# Altium schematic sheet vme_can_fpga_bridge.SchDoc: =GlobalProjectName
size 594 x 420 mm; SheetNumber: 6; SheetTotal: 8; PageSetup: Record=PageOptions|CenterHorizontal=True|CenterVertical=True|PrintScale=1.00|XCorrection=1.00|YCorrection=1.00|PrintKind=1|BorderSize=5000000|LeftOffset=0|BottomOffset=0|Orientation=2|PaperLength=1000|PaperWidth=1000|Scale=100|PaperSource=15|PrintQuality=1200|MediaType=1|DitherType=10|PaperKind=A3|PrintScaleMode=1; Weight: -; ScaleFactor: -
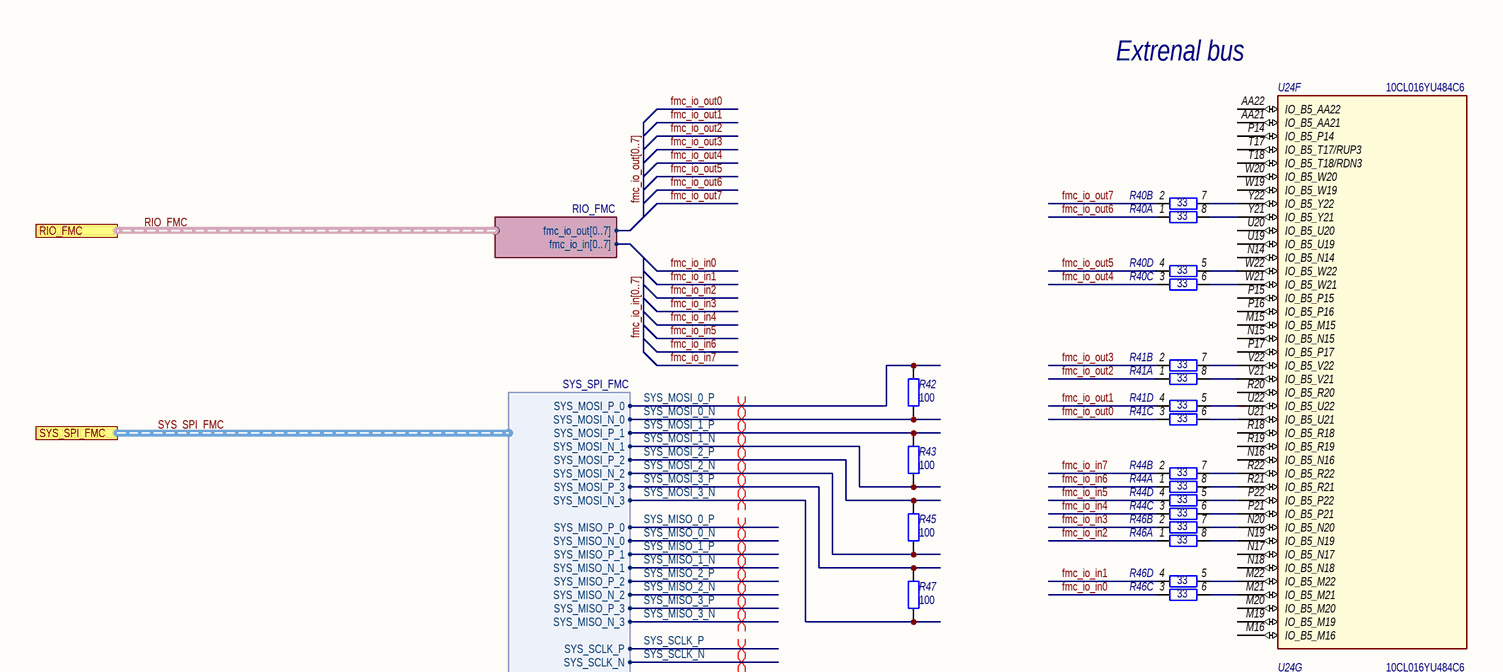
[diagram p0: vme_can_fpga_bridge.SchDoc, top left]
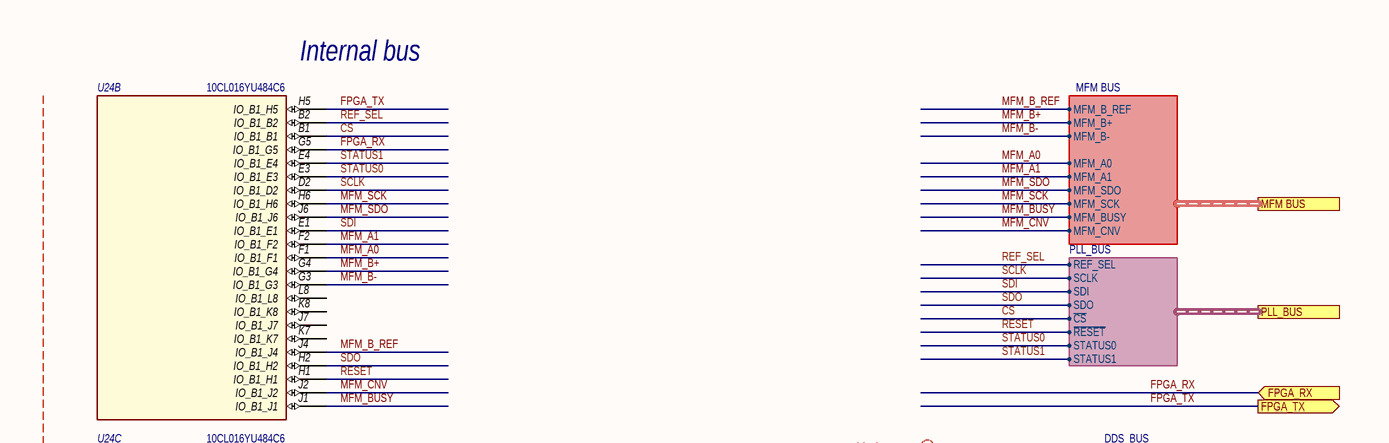
[diagram p1: vme_can_fpga_bridge.SchDoc, top right]
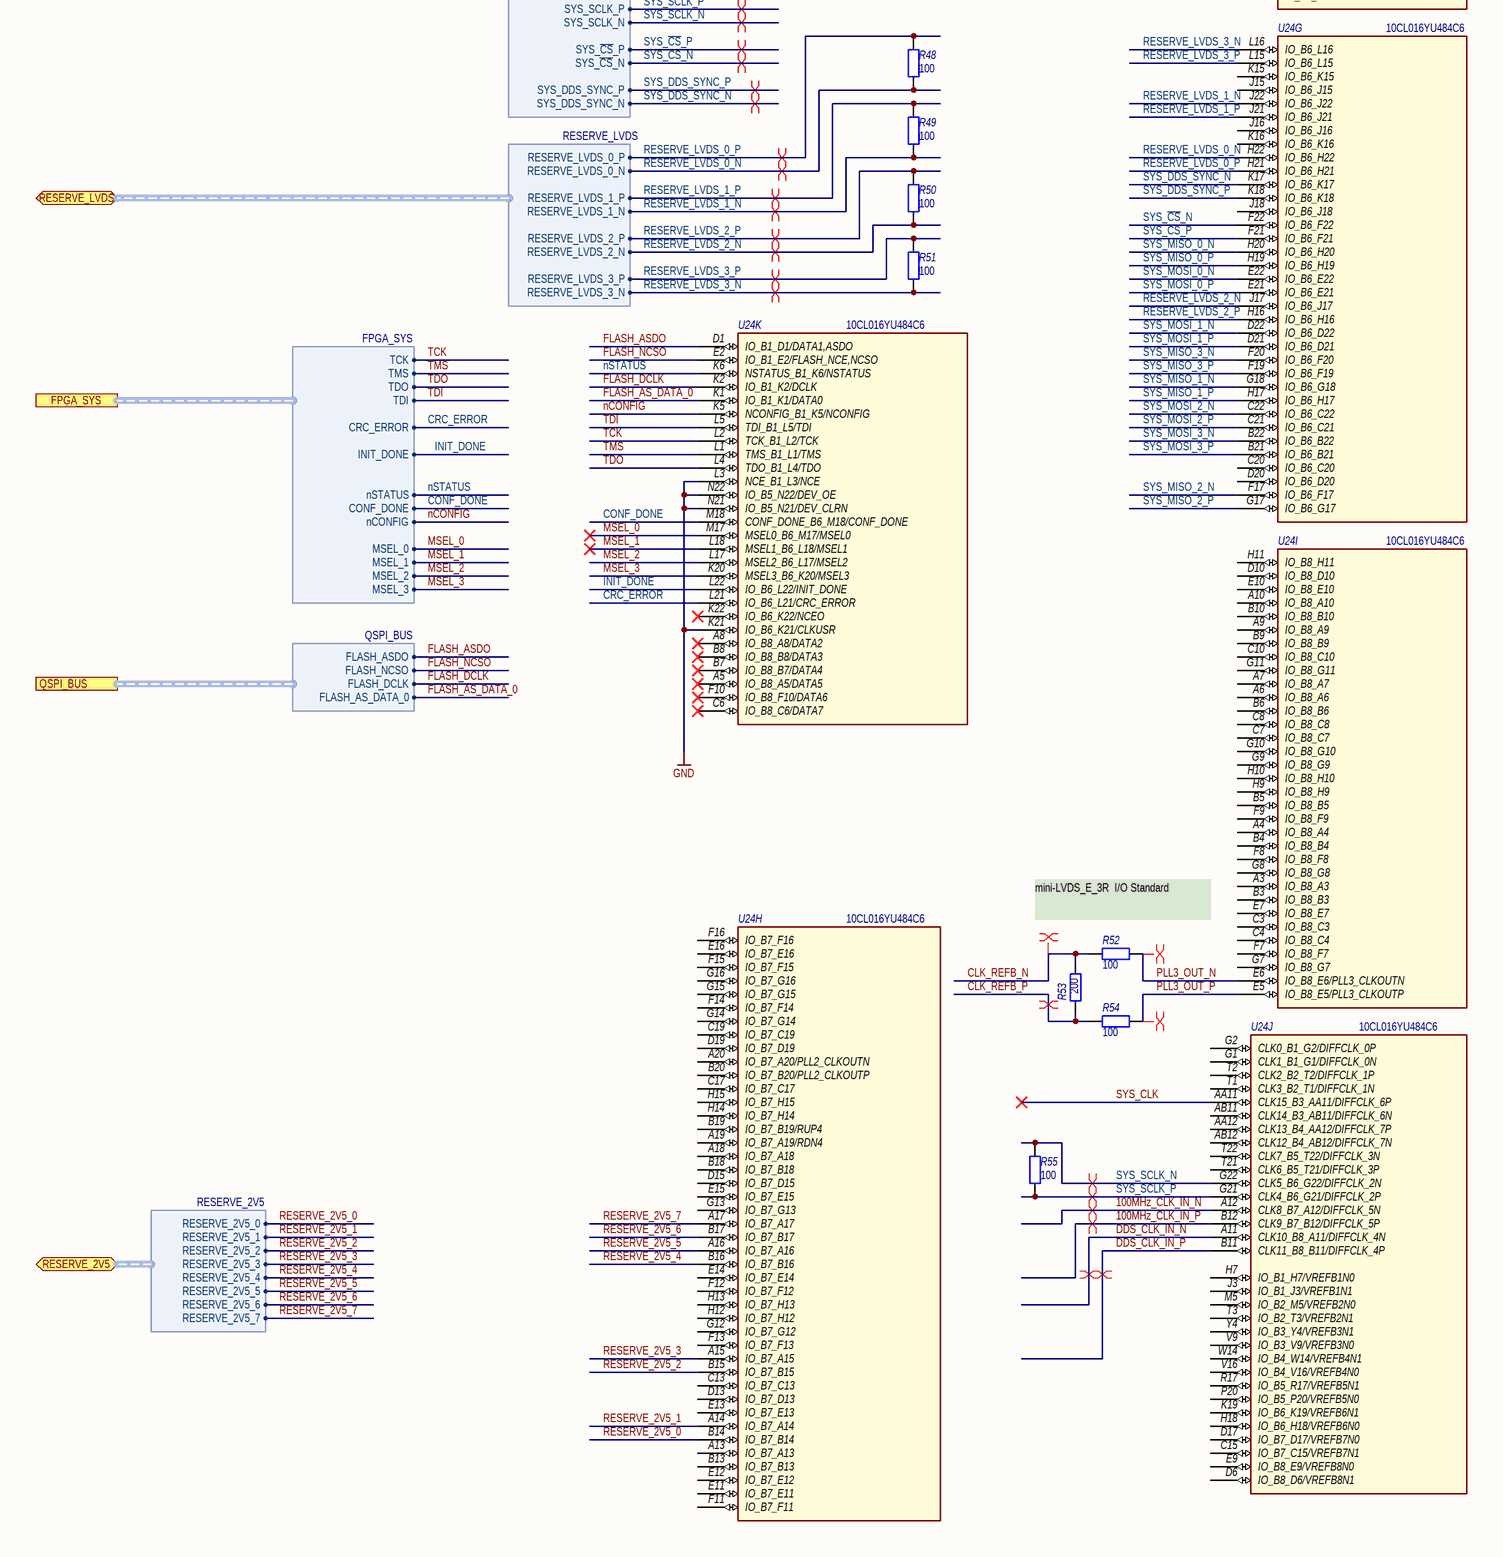
[diagram p2: vme_can_fpga_bridge.SchDoc, bottom left]
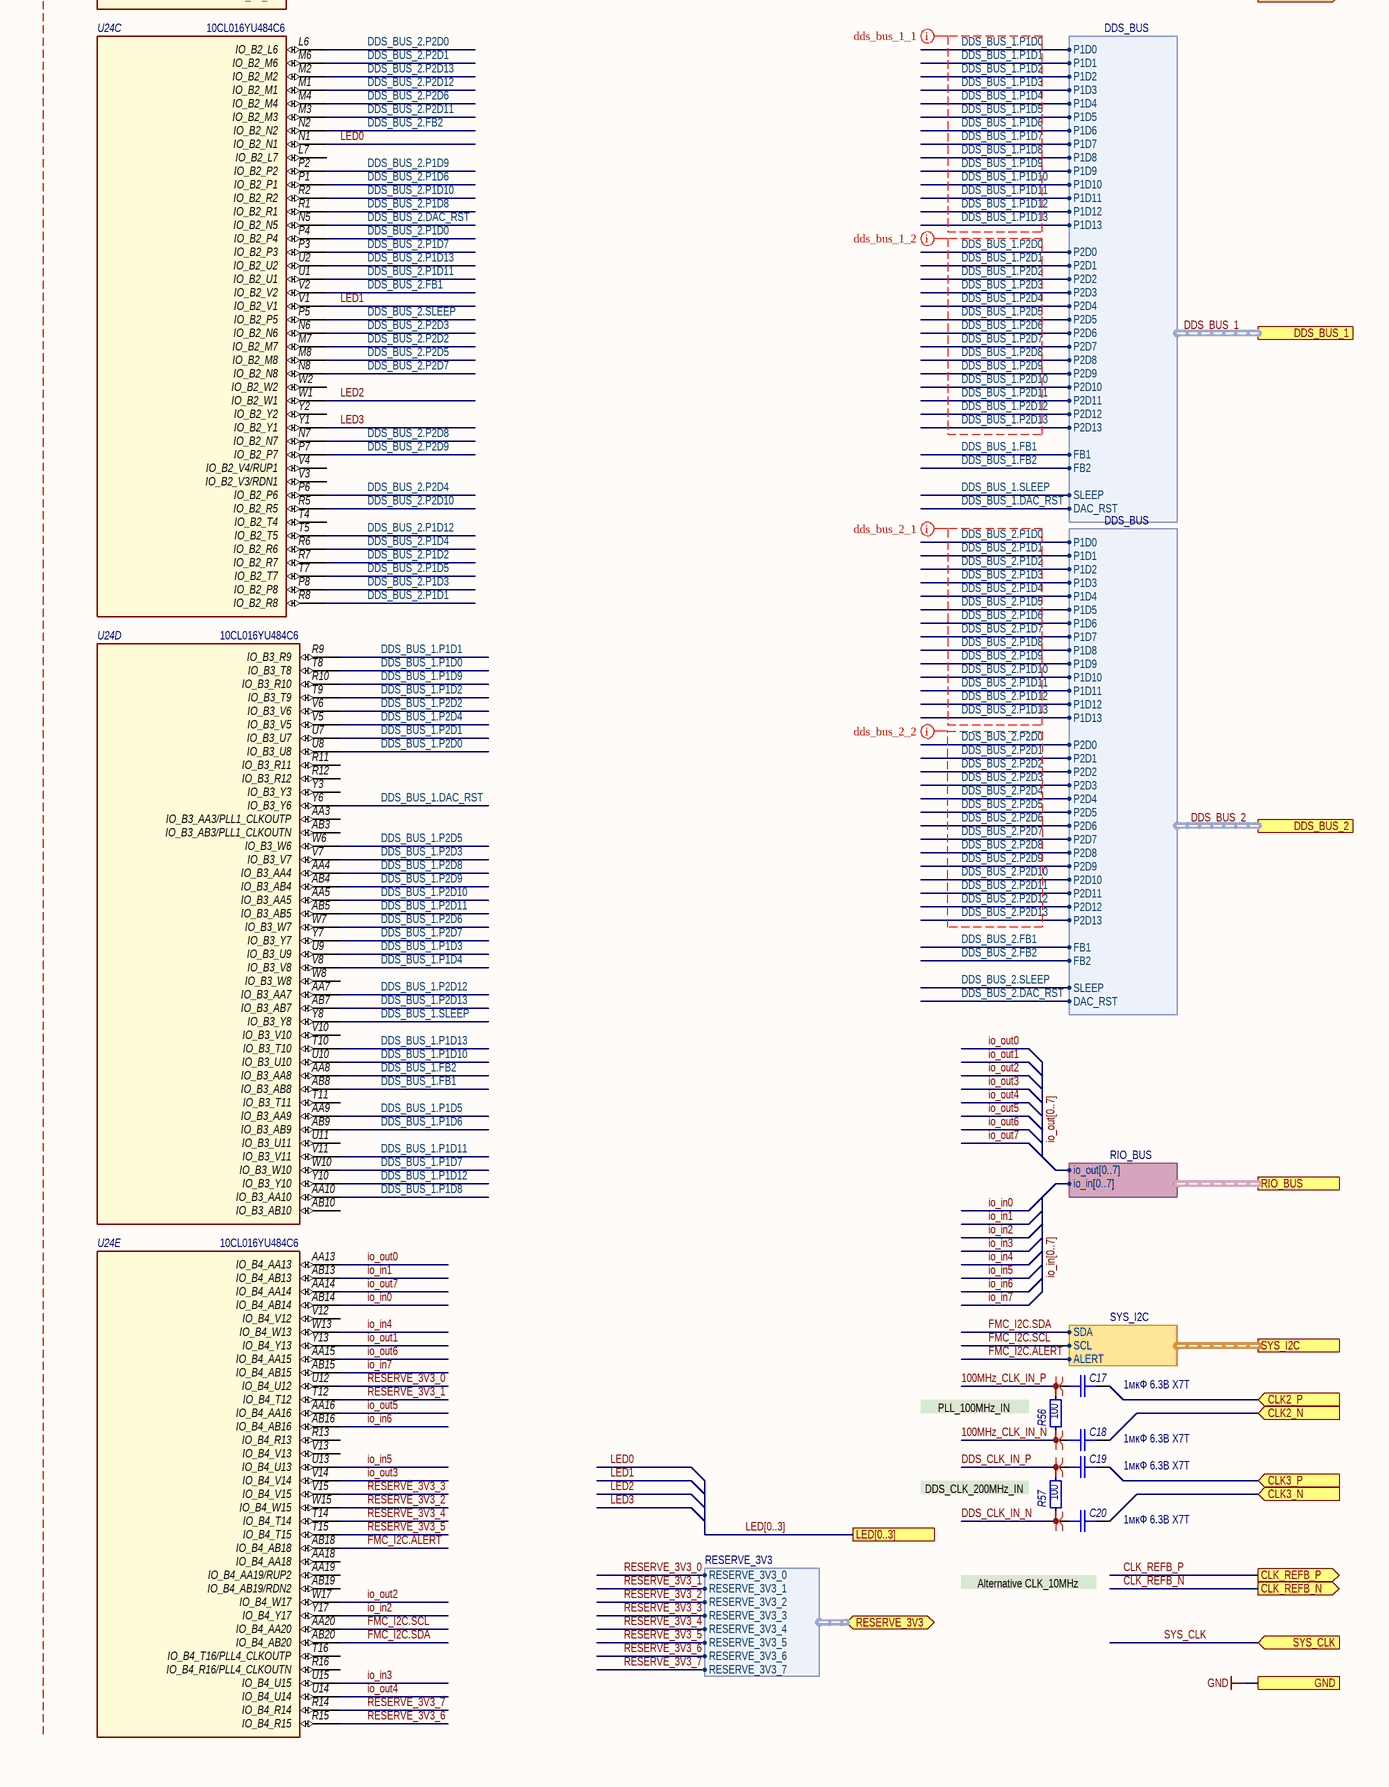
[diagram p3: vme_can_fpga_bridge.SchDoc, bottom right]

## Parts
C17  1мкФ 6.3В X7T  [SMD_C0603]
C18  1мкФ 6.3В X7T  [SMD_C0603]
C19  1мкФ 6.3В X7T  [SMD_C0603]
C20  1мкФ 6.3В X7T  [SMD_C0603]
R40  value 33  [TC124]  (hidden comment: 4 Chip Resistor Array)  (parts A,B,C,D of 4)
R41  value 33  [TC124]  (hidden comment: 4 Chip Resistor Array)  (parts A,B,C,D of 4)
R42  100  [SMD_0603]
R43  100  [SMD_0603]
R44  value 33  [TC124]  (hidden comment: 4 Chip Resistor Array)  (parts A,B,C,D of 4)
R45  100  [SMD_0603]
R46  value 33  [TC124]  (hidden comment: 4 Chip Resistor Array)  (parts A,B,C,D of 4)
R47  100  [SMD_0603]
R48  100  [SMD_0603]
R49  100  [SMD_0603]
R50  100  [SMD_0603]
R51  100  [SMD_0603]
R52  100  [SMD_0603]
R53  200  [SMD_0603]
R54  100  [SMD_0603]
R55  100  [SMD_0603]
R56  100  [SMD_0603]
R57  100  [SMD_0603]
U24  Наименование: 10CL016YU484С6  [UBGA-484]  (hidden comment: 10CL016YU484)  (parts B,C,D,E,F,G,H,I,J,K of 13)

## Ports
CLK2_N (in), CLK2_P (in), CLK3_N (in), CLK3_P (in), CLK_REFB_N (out), CLK_REFB_P (out), DDS_BUS_1 (harness DDS_BUS), DDS_BUS_2 (harness DDS_BUS), FPGA_RX (in), FPGA_SYS (harness FPGA_SYS), FPGA_TX (out), GND, LED[0..3], MFM BUS (harness MFM BUS), PLL_BUS (harness PLL_BUS), QSPI_BUS (harness QSPI_BUS), RESERVE_2V5 (bidir, harness RESERVE_2V5), RESERVE_3V3 (bidir, harness RESERVE_3V3), RESERVE_LVDS (bidir, harness RESERVE_LVDS), RIO_BUS (harness RIO_BUS), RIO_FMC (harness RIO_FMC), SYS_CLK (in), SYS_I2C (harness SYS_I2C), SYS_SPI_FMC (harness SYS_SPI_FMC)

## Harnesses
MFM BUS: MFM_A0, MFM_A1, MFM_SDO, MFM_SCK, MFM_BUSY, MFM_CNV, MFM_B_REF, MFM_B+, MFM_B-
RIO_FMC: fmc_io_out[0..7], fmc_io_in[0..7]
FPGA_SYS: TCK, TMS, TDO, TDI, CRC_ERROR, nSTATUS, CONF_DONE, nCONFIG, MSEL_0, MSEL_1, MSEL_2, MSEL_3, INIT_DONE
SYS_SPI_FMC: SYS_MOSI_P_0, SYS_SCLK_P, SYS_~{CS}_P, SYS_MOSI_P_1, SYS_MOSI_P_2, SYS_MOSI_P_3, SYS_MOSI_N_0, SYS_MOSI_N_1, SYS_MOSI_N_2, SYS_MOSI_N_3, SYS_MISO_P_0, SYS_MISO_P_1, SYS_MISO_P_2, SYS_MISO_P_3, SYS_MISO_N_0, SYS_MISO_N_1, SYS_MISO_N_2, SYS_MISO_N_3, SYS_SCLK_N, SYS_DDS_SYNC_P, SYS_~{CS}_N, SYS_DDS_SYNC_N
SYS_I2C: SDA, SCL, ALERT
PLL_BUS: REF_SEL, SCLK, SDI, SDO, ~{CS}, ~{RESET}, STATUS0, STATUS1
RIO_BUS: io_out[0..7], io_in[0..7]
RESERVE_LVDS: RESERVE_LVDS_0_P, RESERVE_LVDS_0_N, RESERVE_LVDS_1_P, RESERVE_LVDS_1_N, RESERVE_LVDS_2_P, RESERVE_LVDS_2_N, RESERVE_LVDS_3_P, RESERVE_LVDS_3_N
RESERVE_3V3: RESERVE_3V3_0, RESERVE_3V3_1, RESERVE_3V3_2, RESERVE_3V3_3, RESERVE_3V3_4, RESERVE_3V3_5, RESERVE_3V3_6, RESERVE_3V3_7
QSPI_BUS: FLASH_ASDO, FLASH_NCSO, FLASH_DCLK, FLASH_AS_DATA_0
RESERVE_2V5: RESERVE_2V5_0, RESERVE_2V5_1, RESERVE_2V5_2, RESERVE_2V5_3, RESERVE_2V5_4, RESERVE_2V5_5, RESERVE_2V5_6, RESERVE_2V5_7
DDS_BUS: P1D0, P1D1, P1D2, P1D3, P1D4, P1D5, P1D6, P1D7, P1D8, P1D9, P1D10, P1D11, P1D12, P1D13, P2D0, P2D1, P2D2, P2D3, P2D4, P2D5, P2D6, P2D7, P2D8, P2D9, P2D10, P2D11, P2D12, P2D13, FB1, SLEEP, DAC_RST, FB2

## Nets
GND: U24.K21(IO_B6_K21/CLKUSR) U24.L3(NCE_B1_L3/NCE) U24.N21(IO_B5_N21/DEV_CLRN) U24.N22(IO_B5_N22/DEV_OE) ; port GND
100MHz_CLK_IN_N: C18.1 R56.1 U24.A12(CLK8_B7_A12/DIFFCLK_5N)
100MHz_CLK_IN_P: C17.2 R56.2 U24.B12(CLK9_B7_B12/DIFFCLK_5P)
~{CS}: U24.B1(IO_B1_B1) ; port PLL_BUS.~{CS}
CLK2_N: C18.2 ; port CLK2_N
CLK2_P: C17.1 ; port CLK2_P
CLK3_N: C20.2 ; port CLK3_N
CLK3_P: C19.1 ; port CLK3_P
CLK_REFB_N: R52.2 R53.2 ; port CLK_REFB_N
CLK_REFB_P: R53.1 R54.2 ; port CLK_REFB_P
CONF_DONE: U24.M18(CONF_DONE_B6_M18/CONF_DONE) ; port FPGA_SYS.CONF_DONE
CRC_ERROR: U24.L21(IO_B6_L21/CRC_ERROR) ; port FPGA_SYS.CRC_ERROR
DDS_BUS_1.DAC_RST: U24.Y6(IO_B3_Y6) ; port DDS_BUS_1.DAC_RST
DDS_BUS_1.FB1: U24.AB8(IO_B3_AB8) ; port DDS_BUS_1.FB1
DDS_BUS_1.FB2: U24.AA8(IO_B3_AA8) ; port DDS_BUS_1.FB2
DDS_BUS_1.P1D0: U24.T8(IO_B3_T8) ; port DDS_BUS_1.P1D0
DDS_BUS_1.P1D1: U24.R9(IO_B3_R9) ; port DDS_BUS_1.P1D1
DDS_BUS_1.P1D2: U24.T9(IO_B3_T9) ; port DDS_BUS_1.P1D2
DDS_BUS_1.P1D3: U24.U9(IO_B3_U9) ; port DDS_BUS_1.P1D3
DDS_BUS_1.P1D4: U24.V8(IO_B3_V8) ; port DDS_BUS_1.P1D4
DDS_BUS_1.P1D5: U24.AA9(IO_B3_AA9) ; port DDS_BUS_1.P1D5
DDS_BUS_1.P1D6: U24.AB9(IO_B3_AB9) ; port DDS_BUS_1.P1D6
DDS_BUS_1.P1D7: U24.W10(IO_B3_W10) ; port DDS_BUS_1.P1D7
DDS_BUS_1.P1D8: U24.AA10(IO_B3_AA10) ; port DDS_BUS_1.P1D8
DDS_BUS_1.P1D9: U24.R10(IO_B3_R10) ; port DDS_BUS_1.P1D9
DDS_BUS_1.P1D10: U24.U10(IO_B3_U10) ; port DDS_BUS_1.P1D10
DDS_BUS_1.P1D11: U24.V11(IO_B3_V11) ; port DDS_BUS_1.P1D11
DDS_BUS_1.P1D12: U24.Y10(IO_B3_Y10) ; port DDS_BUS_1.P1D12
DDS_BUS_1.P1D13: U24.T10(IO_B3_T10) ; port DDS_BUS_1.P1D13
DDS_BUS_1.P2D0: U24.U8(IO_B3_U8) ; port DDS_BUS_1.P2D0
DDS_BUS_1.P2D1: U24.U7(IO_B3_U7) ; port DDS_BUS_1.P2D1
DDS_BUS_1.P2D2: U24.V6(IO_B3_V6) ; port DDS_BUS_1.P2D2
DDS_BUS_1.P2D3: U24.V7(IO_B3_V7) ; port DDS_BUS_1.P2D3
DDS_BUS_1.P2D4: U24.V5(IO_B3_V5) ; port DDS_BUS_1.P2D4
DDS_BUS_1.P2D5: U24.W6(IO_B3_W6) ; port DDS_BUS_1.P2D5
DDS_BUS_1.P2D6: U24.W7(IO_B3_W7) ; port DDS_BUS_1.P2D6
DDS_BUS_1.P2D7: U24.Y7(IO_B3_Y7) ; port DDS_BUS_1.P2D7
DDS_BUS_1.P2D8: U24.AA4(IO_B3_AA4) ; port DDS_BUS_1.P2D8
DDS_BUS_1.P2D9: U24.AB4(IO_B3_AB4) ; port DDS_BUS_1.P2D9
DDS_BUS_1.P2D10: U24.AA5(IO_B3_AA5) ; port DDS_BUS_1.P2D10
DDS_BUS_1.P2D11: U24.AB5(IO_B3_AB5) ; port DDS_BUS_1.P2D11
DDS_BUS_1.P2D12: U24.AA7(IO_B3_AA7) ; port DDS_BUS_1.P2D12
DDS_BUS_1.P2D13: U24.AB7(IO_B3_AB7) ; port DDS_BUS_1.P2D13
DDS_BUS_1.SLEEP: U24.Y8(IO_B3_Y8) ; port DDS_BUS_1.SLEEP
DDS_BUS_2.DAC_RST: U24.N5(IO_B2_N5) ; port DDS_BUS_2.DAC_RST
DDS_BUS_2.FB1: U24.V2(IO_B2_V2) ; port DDS_BUS_2.FB1
DDS_BUS_2.FB2: U24.N2(IO_B2_N2) ; port DDS_BUS_2.FB2
DDS_BUS_2.P1D0: U24.P4(IO_B2_P4) ; port DDS_BUS_2.P1D0
DDS_BUS_2.P1D1: U24.R8(IO_B2_R8) ; port DDS_BUS_2.P1D1
DDS_BUS_2.P1D2: U24.R7(IO_B2_R7) ; port DDS_BUS_2.P1D2
DDS_BUS_2.P1D3: U24.P8(IO_B2_P8) ; port DDS_BUS_2.P1D3
DDS_BUS_2.P1D4: U24.R6(IO_B2_R6) ; port DDS_BUS_2.P1D4
DDS_BUS_2.P1D5: U24.T7(IO_B2_T7) ; port DDS_BUS_2.P1D5
DDS_BUS_2.P1D6: U24.P1(IO_B2_P1) ; port DDS_BUS_2.P1D6
DDS_BUS_2.P1D7: U24.P3(IO_B2_P3) ; port DDS_BUS_2.P1D7
DDS_BUS_2.P1D8: U24.R1(IO_B2_R1) ; port DDS_BUS_2.P1D8
DDS_BUS_2.P1D9: U24.P2(IO_B2_P2) ; port DDS_BUS_2.P1D9
DDS_BUS_2.P1D10: U24.R2(IO_B2_R2) ; port DDS_BUS_2.P1D10
DDS_BUS_2.P1D11: U24.U1(IO_B2_U1) ; port DDS_BUS_2.P1D11
DDS_BUS_2.P1D12: U24.T5(IO_B2_T5) ; port DDS_BUS_2.P1D12
DDS_BUS_2.P1D13: U24.U2(IO_B2_U2) ; port DDS_BUS_2.P1D13
DDS_BUS_2.P2D0: U24.L6(IO_B2_L6) ; port DDS_BUS_2.P2D0
DDS_BUS_2.P2D1: U24.M6(IO_B2_M6) ; port DDS_BUS_2.P2D1
DDS_BUS_2.P2D2: U24.M7(IO_B2_M7) ; port DDS_BUS_2.P2D2
DDS_BUS_2.P2D3: U24.N6(IO_B2_N6) ; port DDS_BUS_2.P2D3
DDS_BUS_2.P2D4: U24.P6(IO_B2_P6) ; port DDS_BUS_2.P2D4
DDS_BUS_2.P2D5: U24.M8(IO_B2_M8) ; port DDS_BUS_2.P2D5
DDS_BUS_2.P2D6: U24.M4(IO_B2_M4) ; port DDS_BUS_2.P2D6
DDS_BUS_2.P2D7: U24.N8(IO_B2_N8) ; port DDS_BUS_2.P2D7
DDS_BUS_2.P2D8: U24.N7(IO_B2_N7) ; port DDS_BUS_2.P2D8
DDS_BUS_2.P2D9: U24.P7(IO_B2_P7) ; port DDS_BUS_2.P2D9
DDS_BUS_2.P2D10: U24.R5(IO_B2_R5) ; port DDS_BUS_2.P2D10
DDS_BUS_2.P2D11: U24.M3(IO_B2_M3) ; port DDS_BUS_2.P2D11
DDS_BUS_2.P2D12: U24.M1(IO_B2_M1) ; port DDS_BUS_2.P2D12
DDS_BUS_2.P2D13: U24.M2(IO_B2_M2) ; port DDS_BUS_2.P2D13
DDS_BUS_2.SLEEP: U24.P5(IO_B2_P5) ; port DDS_BUS_2.SLEEP
DDS_CLK_IN_N: C20.1 R57.1 U24.A11(CLK10_B8_A11/DIFFCLK_4N)
DDS_CLK_IN_P: C19.2 R57.2 U24.B11(CLK11_B8_B11/DIFFCLK_4P)
FLASH_AS_DATA_0: U24.K1(IO_B1_K1/DATA0) ; port QSPI_BUS.FLASH_AS_DATA_0
FLASH_ASDO: U24.D1(IO_B1_D1/DATA1,ASDO) ; port QSPI_BUS.FLASH_ASDO
FLASH_DCLK: U24.K2(IO_B1_K2/DCLK) ; port QSPI_BUS.FLASH_DCLK
FLASH_NCSO: U24.E2(IO_B1_E2/FLASH_NCE,NCSO) ; port QSPI_BUS.FLASH_NCSO
FMC_I2C.ALERT: U24.AB18(IO_B4_AB18) ; port SYS_I2C.ALERT
FMC_I2C.SCL: U24.AA20(IO_B4_AA20) ; port SYS_I2C.SCL
FMC_I2C.SDA: U24.AB20(IO_B4_AB20) ; port SYS_I2C.SDA
fmc_io_in0: R46.3
fmc_io_in1: R46.4
fmc_io_in2: R46.1
fmc_io_in3: R46.2
fmc_io_in4: R44.3
fmc_io_in5: R44.4
fmc_io_in6: R44.1
fmc_io_in7: R44.2
fmc_io_out0: R41.3
fmc_io_out1: R41.4
fmc_io_out2: R41.1
fmc_io_out3: R41.2
fmc_io_out4: R40.3
fmc_io_out5: R40.4
fmc_io_out6: R40.1
fmc_io_out7: R40.2
FPGA_RX: U24.G5(IO_B1_G5) ; port FPGA_RX
FPGA_TX: U24.H5(IO_B1_H5) ; port FPGA_TX
INIT_DONE: U24.L22(IO_B6_L22/INIT_DONE) ; port FPGA_SYS.INIT_DONE
io_in0: U24.AB14(IO_B4_AB14)
io_in1: U24.AB13(IO_B4_AB13)
io_in2: U24.Y17(IO_B4_Y17)
io_in3: U24.U15(IO_B4_U15)
io_in4: U24.W13(IO_B4_W13)
io_in5: U24.U13(IO_B4_U13)
io_in6: U24.AB16(IO_B4_AB16)
io_in7: U24.AB15(IO_B4_AB15)
io_out0: U24.AA13(IO_B4_AA13)
io_out1: U24.Y13(IO_B4_Y13)
io_out2: U24.W17(IO_B4_W17)
io_out3: U24.V14(IO_B4_V14)
io_out4: U24.U14(IO_B4_U14)
io_out5: U24.AA16(IO_B4_AA16)
io_out6: U24.AA15(IO_B4_AA15)
io_out7: U24.AA14(IO_B4_AA14)
LED0: U24.N1(IO_B2_N1)
LED1: U24.V1(IO_B2_V1)
LED2: U24.W1(IO_B2_W1)
LED3: U24.Y1(IO_B2_Y1)
MFM_A0: U24.F1(IO_B1_F1) ; port MFM BUS.MFM_A0
MFM_A1: U24.F2(IO_B1_F2) ; port MFM BUS.MFM_A1
MFM_B+: U24.G4(IO_B1_G4) ; port MFM BUS.MFM_B+
MFM_B-: U24.G3(IO_B1_G3) ; port MFM BUS.MFM_B-
MFM_B_REF: U24.J4(IO_B1_J4) ; port MFM BUS.MFM_B_REF
MFM_BUSY: U24.J1(IO_B1_J1) ; port MFM BUS.MFM_BUSY
MFM_CNV: U24.J2(IO_B1_J2) ; port MFM BUS.MFM_CNV
MFM_SCK: U24.H6(IO_B1_H6) ; port MFM BUS.MFM_SCK
MFM_SDO: U24.J6(IO_B1_J6) ; port MFM BUS.MFM_SDO
MSEL_0: U24.M17(MSEL0_B6_M17/MSEL0) ; port FPGA_SYS.MSEL_0
MSEL_1: U24.L18(MSEL1_B6_L18/MSEL1) ; port FPGA_SYS.MSEL_1
MSEL_2: U24.L17(MSEL2_B6_L17/MSEL2) ; port FPGA_SYS.MSEL_2
MSEL_3: U24.K20(MSEL3_B6_K20/MSEL3) ; port FPGA_SYS.MSEL_3
nCONFIG: U24.K5(NCONFIG_B1_K5/NCONFIG) ; port FPGA_SYS.nCONFIG
nSTATUS: U24.K6(NSTATUS_B1_K6/NSTATUS) ; port FPGA_SYS.nSTATUS
PLL3_OUT_N: R52.1 U24.E6(IO_B8_E6/PLL3_CLKOUTN)
PLL3_OUT_P: R54.1 U24.E5(IO_B8_E5/PLL3_CLKOUTP)
~{RESET}: U24.H1(IO_B1_H1) ; port PLL_BUS.~{RESET}
REF_SEL: U24.B2(IO_B1_B2) ; port PLL_BUS.REF_SEL
RESERVE_2V5_0: U24.B14(IO_B7_B14) ; port RESERVE_2V5.RESERVE_2V5_0
RESERVE_2V5_1: U24.A14(IO_B7_A14) ; port RESERVE_2V5.RESERVE_2V5_1
RESERVE_2V5_2: U24.B15(IO_B7_B15) ; port RESERVE_2V5.RESERVE_2V5_2
RESERVE_2V5_3: U24.A15(IO_B7_A15) ; port RESERVE_2V5.RESERVE_2V5_3
RESERVE_2V5_4: U24.B16(IO_B7_B16) ; port RESERVE_2V5.RESERVE_2V5_4
RESERVE_2V5_5: U24.A16(IO_B7_A16) ; port RESERVE_2V5.RESERVE_2V5_5
RESERVE_2V5_6: U24.B17(IO_B7_B17) ; port RESERVE_2V5.RESERVE_2V5_6
RESERVE_2V5_7: U24.A17(IO_B7_A17) ; port RESERVE_2V5.RESERVE_2V5_7
RESERVE_3V3_0: U24.U12(IO_B4_U12) ; port RESERVE_3V3.RESERVE_3V3_0
RESERVE_3V3_1: U24.T12(IO_B4_T12) ; port RESERVE_3V3.RESERVE_3V3_1
RESERVE_3V3_2: U24.W15(IO_B4_W15) ; port RESERVE_3V3.RESERVE_3V3_2
RESERVE_3V3_3: U24.V15(IO_B4_V15) ; port RESERVE_3V3.RESERVE_3V3_3
RESERVE_3V3_4: U24.T14(IO_B4_T14) ; port RESERVE_3V3.RESERVE_3V3_4
RESERVE_3V3_5: U24.T15(IO_B4_T15) ; port RESERVE_3V3.RESERVE_3V3_5
RESERVE_3V3_6: U24.R15(IO_B4_R15) ; port RESERVE_3V3.RESERVE_3V3_6
RESERVE_3V3_7: U24.R14(IO_B4_R14) ; port RESERVE_3V3.RESERVE_3V3_7
RESERVE_LVDS_0_N: R48.2 U24.H22(IO_B6_H22) ; port RESERVE_LVDS.RESERVE_LVDS_0_N
RESERVE_LVDS_0_P: R48.1 U24.H21(IO_B6_H21) ; port RESERVE_LVDS.RESERVE_LVDS_0_P
RESERVE_LVDS_1_N: R49.2 U24.J22(IO_B6_J22) ; port RESERVE_LVDS.RESERVE_LVDS_1_N
RESERVE_LVDS_1_P: R49.1 U24.J21(IO_B6_J21) ; port RESERVE_LVDS.RESERVE_LVDS_1_P
RESERVE_LVDS_2_N: R50.2 U24.J17(IO_B6_J17) ; port RESERVE_LVDS.RESERVE_LVDS_2_N
RESERVE_LVDS_2_P: R50.1 U24.H16(IO_B6_H16) ; port RESERVE_LVDS.RESERVE_LVDS_2_P
RESERVE_LVDS_3_N: R51.2 U24.L16(IO_B6_L16) ; port RESERVE_LVDS.RESERVE_LVDS_3_N
RESERVE_LVDS_3_P: R51.1 U24.L15(IO_B6_L15) ; port RESERVE_LVDS.RESERVE_LVDS_3_P
SCLK: U24.D2(IO_B1_D2) ; port PLL_BUS.SCLK
SDI: U24.E1(IO_B1_E1) ; port PLL_BUS.SDI
SDO: U24.H2(IO_B1_H2) ; port PLL_BUS.SDO
STATUS0: U24.E3(IO_B1_E3) ; port PLL_BUS.STATUS0
STATUS1: U24.E4(IO_B1_E4) ; port PLL_BUS.STATUS1
SYS_~{CS}_N: U24.F22(IO_B6_F22) ; port SYS_SPI_FMC.SYS_~{CS}_N
SYS_~{CS}_P: U24.F21(IO_B6_F21) ; port SYS_SPI_FMC.SYS_~{CS}_P
SYS_CLK: U24.AA11(CLK15_B3_AA11/DIFFCLK_6P) ; port SYS_CLK
SYS_DDS_SYNC_N: U24.K17(IO_B6_K17) ; port SYS_SPI_FMC.SYS_DDS_SYNC_N
SYS_DDS_SYNC_P: U24.K18(IO_B6_K18) ; port SYS_SPI_FMC.SYS_DDS_SYNC_P
SYS_MISO_0_N: U24.H20(IO_B6_H20) ; port SYS_SPI_FMC.SYS_MISO_N_0
SYS_MISO_0_P: U24.H19(IO_B6_H19) ; port SYS_SPI_FMC.SYS_MISO_P_0
SYS_MISO_1_N: U24.G18(IO_B6_G18) ; port SYS_SPI_FMC.SYS_MISO_N_1
SYS_MISO_1_P: U24.H17(IO_B6_H17) ; port SYS_SPI_FMC.SYS_MISO_P_1
SYS_MISO_2_N: U24.F17(IO_B6_F17) ; port SYS_SPI_FMC.SYS_MISO_N_2
SYS_MISO_2_P: U24.G17(IO_B6_G17) ; port SYS_SPI_FMC.SYS_MISO_P_2
SYS_MISO_3_N: U24.F20(IO_B6_F20) ; port SYS_SPI_FMC.SYS_MISO_N_3
SYS_MISO_3_P: U24.F19(IO_B6_F19) ; port SYS_SPI_FMC.SYS_MISO_P_3
SYS_MOSI_0_N: R42.2 U24.E22(IO_B6_E22) ; port SYS_SPI_FMC.SYS_MOSI_N_0
SYS_MOSI_0_P: R42.1 U24.E21(IO_B6_E21) ; port SYS_SPI_FMC.SYS_MOSI_P_0
SYS_MOSI_1_N: R43.2 U24.D22(IO_B6_D22) ; port SYS_SPI_FMC.SYS_MOSI_N_1
SYS_MOSI_1_P: R43.1 U24.D21(IO_B6_D21) ; port SYS_SPI_FMC.SYS_MOSI_P_1
SYS_MOSI_2_N: R45.2 U24.C22(IO_B6_C22) ; port SYS_SPI_FMC.SYS_MOSI_N_2
SYS_MOSI_2_P: R45.1 U24.C21(IO_B6_C21) ; port SYS_SPI_FMC.SYS_MOSI_P_2
SYS_MOSI_3_N: R47.2 U24.B22(IO_B6_B22) ; port SYS_SPI_FMC.SYS_MOSI_N_3
SYS_MOSI_3_P: R47.1 U24.B21(IO_B6_B21) ; port SYS_SPI_FMC.SYS_MOSI_P_3
SYS_SCLK_N: R55.1 U24.G22(CLK5_B6_G22/DIFFCLK_2N) ; port SYS_SPI_FMC.SYS_SCLK_N
SYS_SCLK_P: R55.2 U24.G21(CLK4_B6_G21/DIFFCLK_2P) ; port SYS_SPI_FMC.SYS_SCLK_P
TCK: U24.L2(TCK_B1_L2/TCK) ; port FPGA_SYS.TCK
TDI: U24.L5(TDI_B1_L5/TDI) ; port FPGA_SYS.TDI
TDO: U24.L4(TDO_B1_L4/TDO) ; port FPGA_SYS.TDO
TMS: U24.L1(TMS_B1_L1/TMS) ; port FPGA_SYS.TMS
NetR40_5: R40.5 U24.W22(IO_B5_W22)
NetR40_6: R40.6 U24.W21(IO_B5_W21)
NetR40_7: R40.7 U24.Y22(IO_B5_Y22)
NetR40_8: R40.8 U24.Y21(IO_B5_Y21)
NetR41_5: R41.5 U24.U22(IO_B5_U22)
NetR41_6: R41.6 U24.U21(IO_B5_U21)
NetR41_7: R41.7 U24.V22(IO_B5_V22)
NetR41_8: R41.8 U24.V21(IO_B5_V21)
NetR44_5: R44.5 U24.P22(IO_B5_P22)
NetR44_6: R44.6 U24.P21(IO_B5_P21)
NetR44_7: R44.7 U24.R22(IO_B5_R22)
NetR44_8: R44.8 U24.R21(IO_B5_R21)
NetR46_5: R46.5 U24.M22(IO_B5_M22)
NetR46_6: R46.6 U24.M21(IO_B5_M21)
NetR46_7: R46.7 U24.N20(IO_B5_N20)
NetR46_8: R46.8 U24.N19(IO_B5_N19)

Not connected (* = marked no-connect by the designer): U24 A3(IO_B8_A3) A4(IO_B8_A4) A5(IO_B8_A5/DATA5)* A6(IO_B8_A6) A7(IO_B8_A7) A8(IO_B8_A8/DATA2)* A9(IO_B8_A9) A10(IO_B8_A10) A13(IO_B7_A13) A18(IO_B7_A18) A19(IO_B7_A19/RDN4) A20(IO_B7_A20/PLL2_CLKOUTN) AA3(IO_B3_AA3/PLL1_CLKOUTP) AA12(CLK13_B4_AA12/DIFFCLK_7P) AA18(IO_B4_AA18) AA19(IO_B4_AA19/RUP2) AA21(IO_B5_AA21) AA22(IO_B5_AA22) AB3(IO_B3_AB3/PLL1_CLKOUTN) AB10(IO_B3_AB10) AB11(CLK14_B3_AB11/DIFFCLK_6N) AB12(CLK12_B4_AB12/DIFFCLK_7N) AB19(IO_B4_AB19/RDN2) B3(IO_B8_B3) B4(IO_B8_B4) B5(IO_B8_B5) B6(IO_B8_B6) B7(IO_B8_B7/DATA4)* B8(IO_B8_B8/DATA3)* B9(IO_B8_B9) B10(IO_B8_B10) B13(IO_B7_B13) B18(IO_B7_B18) B19(IO_B7_B19/RUP4) B20(IO_B7_B20/PLL2_CLKOUTP) C3(IO_B8_C3) C4(IO_B8_C4) C6(IO_B8_C6/DATA7)* C7(IO_B8_C7) C8(IO_B8_C8) C10(IO_B8_C10) C13(IO_B7_C13) C15(IO_B7_C15/VREFB7N1) C17(IO_B7_C17) C19(IO_B7_C19) C20(IO_B6_C20) D6(IO_B8_D6/VREFB8N1) D10(IO_B8_D10) D13(IO_B7_D13) D15(IO_B7_D15) D17(IO_B7_D17/VREFB7N0) D19(IO_B7_D19) D20(IO_B6_D20) E7(IO_B8_E7) E9(IO_B8_E9/VREFB8N0) E10(IO_B8_E10) E11(IO_B7_E11) E12(IO_B7_E12) E13(IO_B7_E13) E14(IO_B7_E14) E15(IO_B7_E15) E16(IO_B7_E16) F7(IO_B8_F7) F8(IO_B8_F8) F9(IO_B8_F9) F10(IO_B8_F10/DATA6)* F11(IO_B7_F11) F12(IO_B7_F12) F13(IO_B7_F13) F14(IO_B7_F14) F15(IO_B7_F15) F16(IO_B7_F16) G1(CLK1_B1_G1/DIFFCLK_0N) G2(CLK0_B1_G2/DIFFCLK_0P) G7(IO_B8_G7) G8(IO_B8_G8) G9(IO_B8_G9) G10(IO_B8_G10) G11(IO_B8_G11) G12(IO_B7_G12) G13(IO_B7_G13) G14(IO_B7_G14) G15(IO_B7_G15) G16(IO_B7_G16) H7(IO_B1_H7/VREFB1N0) H9(IO_B8_H9) H10(IO_B8_H10) H11(IO_B8_H11) H12(IO_B7_H12) H13(IO_B7_H13) H14(IO_B7_H14) H15(IO_B7_H15) H18(IO_B6_H18/VREFB6N0) J3(IO_B1_J3/VREFB1N1) J7(IO_B1_J7) J15(IO_B6_J15) J16(IO_B6_J16) J18(IO_B6_J18) K7(IO_B1_K7) K8(IO_B1_K8) K15(IO_B6_K15) K16(IO_B6_K16) K19(IO_B6_K19/VREFB6N1) K22(IO_B6_K22/NCEO)* L7(IO_B2_L7) L8(IO_B1_L8) M5(IO_B2_M5/VREFB2N0) M15(IO_B5_M15) M16(IO_B5_M16) M19(IO_B5_M19) M20(IO_B5_M20) N14(IO_B5_N14) N15(IO_B5_N15) N16(IO_B5_N16) N17(IO_B5_N17) N18(IO_B5_N18) P14(IO_B5_P14) P15(IO_B5_P15) P16(IO_B5_P16) P17(IO_B5_P17) P20(IO_B5_P20/VREFB5N0) R11(IO_B3_R11) R12(IO_B3_R12) R13(IO_B4_R13) R16(IO_B4_R16/PLL4_CLKOUTN) R17(IO_B5_R17/VREFB5N1) R18(IO_B5_R18) R19(IO_B5_R19) R20(IO_B5_R20) T1(CLK3_B2_T1/DIFFCLK_1N) T2(CLK2_B2_T2/DIFFCLK_1P) T3(IO_B2_T3/VREFB2N1) T4(IO_B2_T4) T11(IO_B3_T11) T16(IO_B4_T16/PLL4_CLKOUTP) T17(IO_B5_T17/RUP3) T18(IO_B5_T18/RDN3) T21(CLK6_B5_T21/DIFFCLK_3P) T22(CLK7_B5_T22/DIFFCLK_3N) U11(IO_B3_U11) U19(IO_B5_U19) U20(IO_B5_U20) V3(IO_B2_V3/RDN1) V4(IO_B2_V4/RUP1) V9(IO_B3_V9/VREFB3N0) V10(IO_B3_V10) V12(IO_B4_V12) V13(IO_B4_V13) V16(IO_B4_V16/VREFB4N0) W2(IO_B2_W2) W8(IO_B3_W8) W14(IO_B4_W14/VREFB4N1) W19(IO_B5_W19) W20(IO_B5_W20) Y2(IO_B2_Y2) Y3(IO_B3_Y3) Y4(IO_B3_Y4/VREFB3N1)

## Buses and harness runs
bus fmc_io_in[0..7]
bus fmc_io_out[0..7]
bus io_in[0..7]
bus io_out[0..7]
bus LED[0..3] = port LED[0..3]
harness DDS_BUS_1 = port DDS_BUS_1
harness DDS_BUS_2 = port DDS_BUS_2
harness RIO_FMC = port RIO_FMC
harness SYS_SPI_FMC = port SYS_SPI_FMC

## Layout directives
differential pair: 100MHz_CLK_IN_N, 100MHz_CLK_IN_P, CLK_REFB_N, CLK_REFB_P, DDS_CLK_IN_N, DDS_CLK_IN_P, PLL3_OUT_N, PLL3_OUT_P, RESERVE_LVDS_0_N, RESERVE_LVDS_0_P, RESERVE_LVDS_1_N, RESERVE_LVDS_1_P, RESERVE_LVDS_2_N, RESERVE_LVDS_2_P, RESERVE_LVDS_3_N, RESERVE_LVDS_3_P, SYS_DDS_SYNC_N, SYS_DDS_SYNC_P, SYS_MISO_0_N, SYS_MISO_0_P, SYS_MISO_1_N, SYS_MISO_1_P, SYS_MISO_2_N, SYS_MISO_2_P, SYS_MISO_3_N, SYS_MISO_3_P, SYS_MOSI_0_N, SYS_MOSI_0_P, SYS_MOSI_1_N, SYS_MOSI_1_P, SYS_MOSI_2_N, SYS_MOSI_2_P, SYS_MOSI_3_N, SYS_MOSI_3_P, SYS_SCLK_N, SYS_SCLK_P, SYS_~{CS}_N, SYS_~{CS}_P
net class dds_bus_1_1: DDS_BUS_1.P1D0, DDS_BUS_1.P1D1, DDS_BUS_1.P1D2, DDS_BUS_1.P1D3, DDS_BUS_1.P1D4, DDS_BUS_1.P1D5, DDS_BUS_1.P1D6, DDS_BUS_1.P1D7, DDS_BUS_1.P1D8, DDS_BUS_1.P1D9, DDS_BUS_1.P1D10, DDS_BUS_1.P1D11, DDS_BUS_1.P1D12, DDS_BUS_1.P1D13
net class dds_bus_1_2: DDS_BUS_1.P2D0, DDS_BUS_1.P2D1, DDS_BUS_1.P2D2, DDS_BUS_1.P2D3, DDS_BUS_1.P2D4, DDS_BUS_1.P2D5, DDS_BUS_1.P2D6, DDS_BUS_1.P2D7, DDS_BUS_1.P2D8, DDS_BUS_1.P2D9, DDS_BUS_1.P2D10, DDS_BUS_1.P2D11, DDS_BUS_1.P2D12, DDS_BUS_1.P2D13
net class dds_bus_2_1: DDS_BUS_2.P1D0, DDS_BUS_2.P1D1, DDS_BUS_2.P1D2, DDS_BUS_2.P1D3, DDS_BUS_2.P1D4, DDS_BUS_2.P1D5, DDS_BUS_2.P1D6, DDS_BUS_2.P1D7, DDS_BUS_2.P1D8, DDS_BUS_2.P1D9, DDS_BUS_2.P1D10, DDS_BUS_2.P1D11, DDS_BUS_2.P1D12, DDS_BUS_2.P1D13
net class dds_bus_2_2: DDS_BUS_2.P2D0, DDS_BUS_2.P2D1, DDS_BUS_2.P2D2, DDS_BUS_2.P2D3, DDS_BUS_2.P2D4, DDS_BUS_2.P2D5, DDS_BUS_2.P2D6, DDS_BUS_2.P2D7, DDS_BUS_2.P2D8, DDS_BUS_2.P2D9, DDS_BUS_2.P2D10, DDS_BUS_2.P2D11, DDS_BUS_2.P2D12, DDS_BUS_2.P2D13

## Notes on the sheet
- (near U24) Extrenal bus
- (near U24) Internal bus
- mini-LVDS_E_3R  I/O Standard
- PLL_100MHz_IN
- DDS_CLK_200MHz_IN
- Alternative CLK_10MHz
- Перв. примен.
- Справ. №
- Подп. и дата
- Инв. № дубл.
- Взам. инв. №
- Инв. № подл.
- Изм.
- Лист
- № докум.
- Подп.
- Дата
- Форма 2а ГОСТ 2.104-2006
- Копировал
- Формат А2

## Library data of the parts
C17-C20 = Capacitor: Назначение: SMD-конденсатор; Наименование: GRM033D70J105ME01; Потребление, Вт: 0; Value: 1мкФ 6.3В X7T
R40 R41 R44 R46 = Resistor-4: Потребление, Вт: 0.0; Наименование: TC124-FR-0733RL; Назначение: 4 Chip Resistor Array; Описание: TC124-FR-0733RL
R42 R43 R45 R47-R57 = Resistor: Наименование: Резистор; Назначение: SMD-резистор; Потребление, Вт: 0,001
  R42 R43 R45 R47-R52 R54-R57: Value: 100
  R53: Value: 200
U24 = 10CL016_U484: Intel® Cyclone® 10 LP FPGA; Потребление, Вт: 0.5; Назначение: Intel® Cyclone® 10 LP FPGA; ComponentLink1Description: DataSheet; ComponentLink1URL: https://www.intel.com/content/dam/www/programmable/us/en/pdfs/literature/hb/cyclone-10/c10lp-51002.pdf; ComponentLink2Description: PinConnectionGuidlines; ComponentLink2URL: https://www.intel.com/content/dam/www/programmable/us/en/pdfs/literature/dp/cyclone-10/pcg-01021.pdf; Supplier 1: Mouser; Supplier Part Number 1: 989-10CL016YU484C6G